# EAGLE design PiGarage (EAGLE 9.5.2)
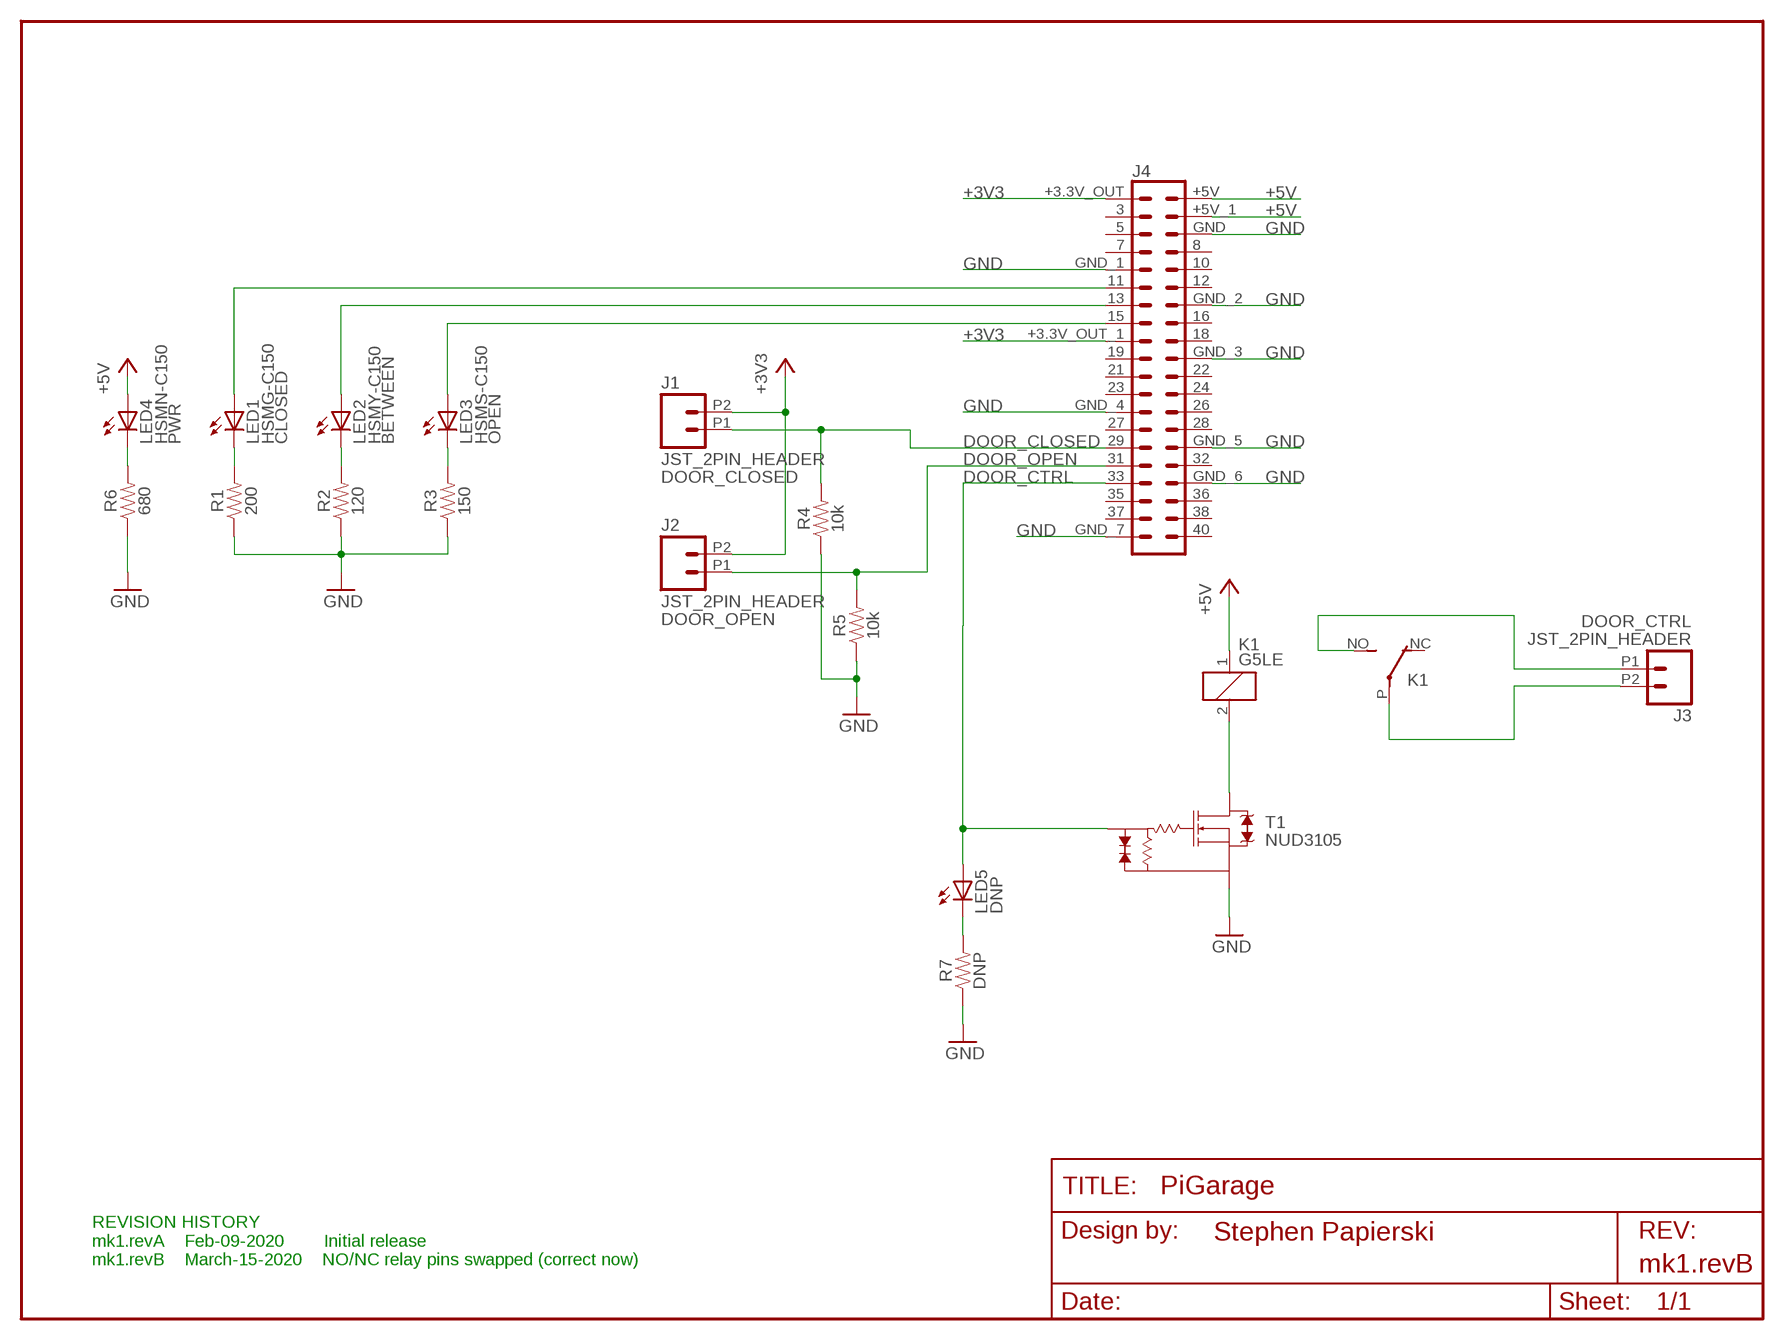
[diagram p0: schematic, sheet 1]

## Parts
FRAME1  FRAME-LETTERNO_PACKAGE  [DUMMY]
J1  JST_2PIN_HEADER  [JST_2PIN_RIGHT_HEADER]
J2  JST_2PIN_HEADER  [JST_2PIN_RIGHT_HEADER]
J3  JST_2PIN_HEADER  [JST_2PIN_RIGHT_HEADER]
J4  RPI-GPIO-20X2  [RPI-GPIO-20X2]
K1  G5LE  [G5LE]
LED1  HSMG-C150  LEDCHIPLED_1206  [CHIPLED_1206]
LED2  HSMY-C150  LEDCHIPLED_1206  [CHIPLED_1206]
LED3  HSMS-C150  LEDCHIPLED_1206  [CHIPLED_1206]
LED4  HSMN-C150  LEDCHIPLED_1206  [CHIPLED_1206]
LED5  DNP  LEDCHIPLED_1206  [CHIPLED_1206]
R1  200  RESISTOR0805  [0805]
R2  120  RESISTOR0805  [0805]
R3  150  RESISTOR0805  [0805]
R4  10k  RESISTOR0805  [0805]
R5  10k  RESISTOR0805  [0805]
R6  680  RESISTOR0805  [0805]
R7  DNP  RESISTOR0805  [0805]
T1  NUD3105  [SOT23]

## Nets
+3V3: J1.P2 J2.P2 J4.+3.3V_OUT J4.+3.3V_OUT_1
+5V: J4.+5V J4.+5V_1 K1.1 LED4.A
DOOR_CLOSED: J1.P1 J4.29 R4.2
DOOR_CTRL: J4.33 LED5.A T1.1(G)
DOOR_OPEN: J2.P1 J4.31 R5.2
GND: J4.GND J4.GND_1 J4.GND_2 J4.GND_3 J4.GND_4 J4.GND_5 J4.GND_6 J4.GND_7 R1.1 R2.1 R3.1 R4.1 R5.1 R6.1 R7.1 T1.2(S)
N$1: K1.2 T1.3(D)
N$2: LED5.C R7.2
N$4: J3.P1 K1.NO(2:NO)
N$5: J3.P2 K1.P(2:P)
N$6: LED4.C R6.2
N$7: J4.11 LED1.A
N$8: J4.13 LED2.A
N$9: J4.15 LED3.A
N$11: LED1.C R1.2
N$12: LED2.C R2.2
N$13: LED3.C R3.2
Unconnected: J4.3 J4.5 J4.7 J4.8 J4.10 J4.12 J4.16 J4.18 J4.19 J4.21 J4.22 J4.23 J4.24 J4.26 J4.27 J4.28 J4.32 J4.35 J4.36 J4.37 J4.38 J4.40 K1.NC(2:NC)

## Notes on the sheet
- PWR | CLOSED | BETWEEN | OPEN
- DOOR_CLOSED
- DOOR_CTRL
- DOOR_OPEN
- REVISION HISTORY
  mk1.revA    Feb-09-2020        Initial release
  mk1.revB    March-15-2020    NO/NC relay pins swapped (correct now)

## Library data of the parts
FRAME1 = eagle_stephen_v1.1:FRAME-LETTER: Schematic Frame - Letter Standard 8.5x11 US Letter frame; DESIGNER: Stephen Papierski; REV: mk1.revB
J1-J3 = eagle_stephen_v1.1:JST_2PIN_HEADER: 2 Pin JST Shrouded Header https://www.sparkfun.com/products/9914
J4 = eagle_stephen_v1.1:RPI-GPIO-20X2: Raspberry Pi GPIO Pinout On any of the 0.1 inch spaced packages, you can populate with these: Stackable 0.100" Female Header 2x20-Pin, Straight <https://www.pololu.com/product/2748> (PRT-2748)
K1 = eagle_stephen_v1.1:G5LE: RELAY 1 x switch, 10 A/120 V AC, 8 A/30 V DC, Omron; OC_FARNELL: unknown; OC_NEWARK: unknown
LED1-LED5 = led:LED: LED OSRAM: - CHIPLED LG R971, LG N971, LY N971, LG Q971, LY Q971, LO R971, LY R971 LH N974, LH R974 LS Q976, LO Q976, LY Q976 LO Q996 - Hyper CHIPLED LW Q18S LB Q993, LB Q99A, LB R99A - SideLED LS A670, LO A670, LY A670, LG A670, LP A670 LB A673, LV A673, LT A673, LW A673 LH A674 LY A675 LS A676, LA A676, LO A676, LY A676, LW A676 LS A679, LY A679, LG A679 - Hyper Micro SIDELED® LS Y876, LA Y876, LO Y876, LY Y876 LT Y87S - SmartLED LW L88C, LW L88S LB L89C, LB L89S, LG L890 LS L89K, LO L89K, LY L89K LS L896, LA L896, LO L896, LY L896 - TOPLED LS T670, LO T670, LY T670, LG T670, LP T670 LSG T670, LSP T670, LSY T670, LOP T670, LYG T670 LG T671, LOG T671, LSG T671 LB T673, LV T673, LT T673, LW T673 LH T674 LS T676, LA T676, LO T676, LY T676, LB T676, LH T676, LSB T676, LW T676 LB T67C, LV T67C, LT T67C, LS T67K, LO T67K, LY T67K, LW E67C LS E67B, LA E67B, LO E67B, LY E67B, LB E67C, LV E67C, LT E67C LW T67C LS T679, LY T679, LG T679 LS T770, LO T770, LY T770, LG T770, LP T770 LB T773, LV T773, LT T773, LW T773 LH T774 LS E675, LA E675, LY E675, LS T675 LS T776, LA T776, LO T776, LY T776, LB T776 LHGB T686 LT T68C, LB T68C - Hyper Mini TOPLED® LB M676 - Mini TOPLED Santana® LG M470 LS M47K, LO M47K, LY M47K Source: http://www.osram.convergy.de LUXEON: - LUMILED® LXK2-PW12-R00, LXK2-PW12-S00, LXK2-PW14-U00, LXK2-PW14-V00 LXK2-PM12-R00, LXK2-PM12-S00, LXK2-PM14-U00 LXK2-PE12-Q00, LXK2-PE12-R00, LXK2-PE12-S00, LXK2-PE14-T00, LXK2-PE14-U00 LXK2-PB12-K00, LXK2-PB12-L00, LXK2-PB12-M00, LXK2-PB14-N00, LXK2-PB14-P00, LXK2-PB14-Q00 LXK2-PR12-L00, LXK2-PR12-M00, LXK2-PR14-Q00, LXK2-PR14-R00 LXK2-PD12-Q00, LXK2-PD12-R00, LXK2-PD12-S00 LXK2-PH12-R00, LXK2-PH12-S00 LXK2-PL12-P00, LXK2-PL12-Q00, LXK2-PL12-R00 Source: www.luxeon.com KINGBRIGHT: KA-3528ASYC Source: www.kingbright.com
R1-R7 = SparkFun-Resistors:RESISTOR: Generic Resistor Package
T1 = eagle_stephen_v1.1:NUD3105: Integrated Relay, Inductive Load Driver This device is used to switch inductive loads such as relays, solenoids, incandescent lamps, and small DC motors without the need of a free−wheeling diode. The device integrates all necessary items such as the MOSFET switch, ESD protection, and Zener clamps. It accepts logic level inputs thus allowing it to be driven by a large variety of devices including logic gates, inverters, and microcontrollers.

## Board
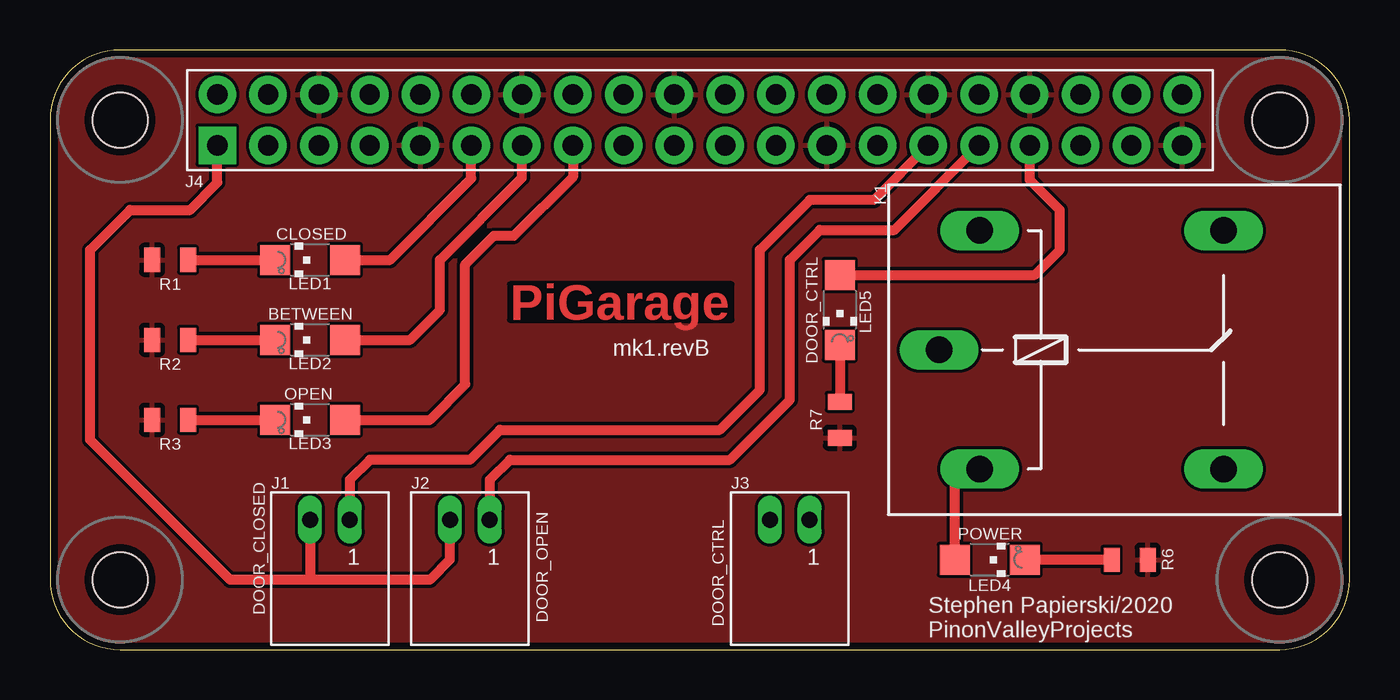
[diagram p1: board, top side]
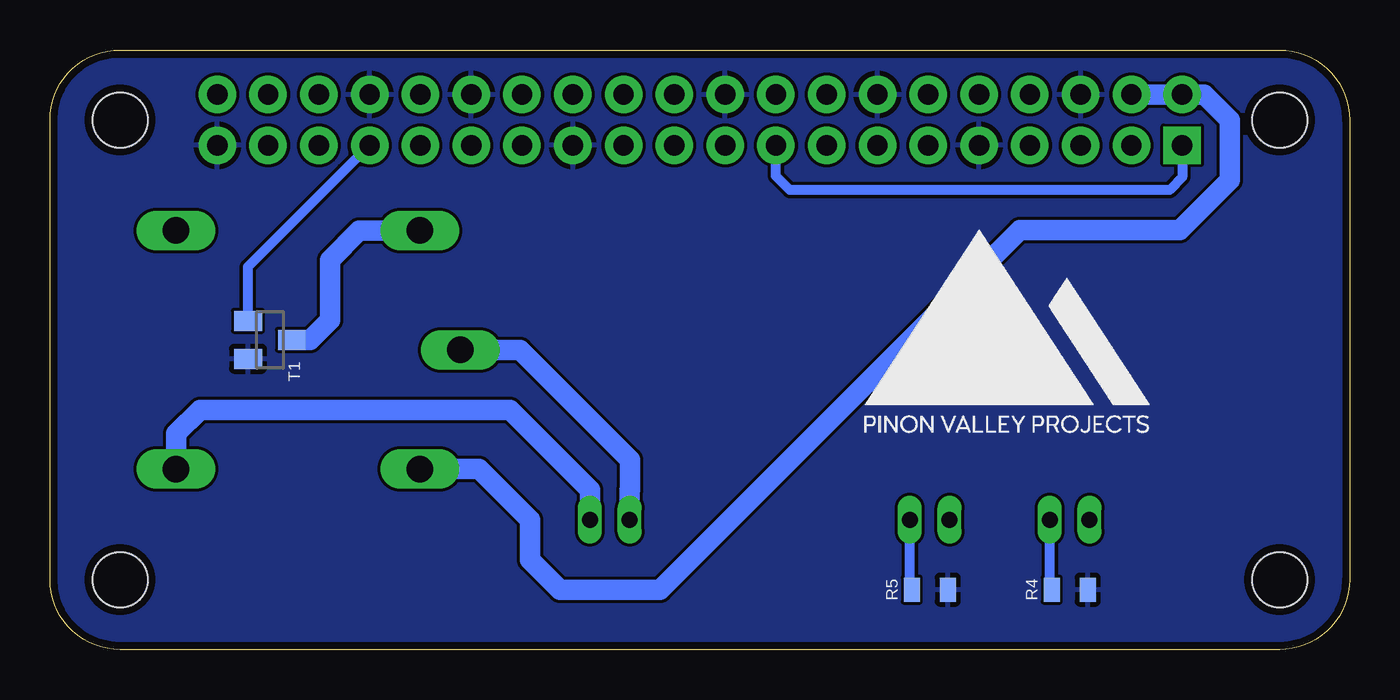
[diagram p2: board, bottom side, seen from below]

Size 65 x 30 mm. Coordinates in mm from the lower left corner, seen from the top.
Outline: 3.5,0 61.5,0 arc90 65,3.5 65,26.5 arc90 61.5,30 3.5,30 arc90 0,26.5 0,3.5 arc90 3.5,0
Copper layers (1*16): Top 0.035559375mm / dielectric 1.6mm / Bottom 0.035559375mm
Design rules "oshpark-2layer": minimum track width 6mil, minimum drill 10mil, track to track 6mil, track to pad 6mil, pad to pad 6mil, via to via 6mil, smd to smd 6mil, copper to edge 15mil, drill to drill 6mil, minimum pad ring 5mil, minimum via ring 5mil, stop-mask expansion 2.5mil, vias tented up to drill 0mil, thermal gap 10mil
Holes 2.75 mm at 3.5,3.5 3.5,26.5 61.5,26.5 61.5,3.5

### Footprints (pad centres in the part's own frame; a part is rotated, then mirrored left to right if it is on the bottom)
JST_2PIN_RIGHT_HEADER = drill 0.8 long: P1 1,0; P2 -1,0
RPI-GPIO-20X2 = drill 1.016 pad 1.88: 3 -21.59,-1.27; 5 -19.05,-1.27; 7 -16.51,-1.27; 8 -16.51,1.27; 10 -13.97,1.27; 11 -11.43,-1.27; 12 -11.43,1.27; 13 -8.89,-1.27; 15 -6.35,-1.27; 16 -6.35,1.27; 18 -3.81,1.27; 19 -1.27,-1.27; 21 1.27,-1.27; 22 1.27,1.27; 23 3.81,-1.27; 24 3.81,1.27; 26 6.35,1.27; 27 8.89,-1.27; 28 8.89,1.27; 29 11.43,-1.27; 31 13.97,-1.27; 32 13.97,1.27; 33 16.51,-1.27; 35 19.05,-1.27; 36 19.05,1.27; 37 21.59,-1.27; 38 21.59,1.27; 40 24.13,1.27; +3.3V_OUT_1 -3.81,-1.27; +5V -24.13,1.27; +5V_1 -21.59,1.27; GND -19.05,1.27; GND_1 -13.97,-1.27; GND_2 -8.89,1.27; GND_3 -1.27,1.27; GND_4 6.35,-1.27; GND_5 11.43,1.27; GND_6 16.51,1.27; GND_7 24.13,-1.27 | drill 1.016 pad 1.88 square: +3.3V_OUT -24.13,-1.27
G5LE = drill 1.321 long: 1 -7.493,-5.969; 2 -7.493,5.969; NC 4.699,5.969; NO 4.699,-5.969; P -9.525,0
CHIPLED_1206 = smd 1.5 x 1.5: A 0,-1.75; C 0,1.75
0805 = smd 0.8 x 1.2: 1 -0.9,0; 2 0.9,0
SOT23 = smd 1 x 1.4: 1 -0.95,-1.1; 2 0.95,-1.1; 3 0,1.1

### Placement (x,y rotation side)
FRAME1  -0.6,-3.2 0 top  (outside the outline)
J1  14,6.5 0 top
J2  21,6.5 0 top
J3  37,6.5 0 top
J4  32.5,26.5 0 top
K1  54,15 0 top
LED1  13,19.5 90 top
LED2  13,15.5 90 top
LED3  13,11.5 90 top
LED4  47,4.5 270 top
LED5  39.5,17 180 top
R1  6,19.5 0 top
R2  6,15.5 0 top
R3  6,11.5 0 top
R4  14,3 180 bottom
R5  21,3 180 bottom
R6  54,4.5 180 top
R7  39.5,11.5 90 top
T1  54,15.5 270 bottom

### Tracks (layer width: path | path; a pad name or v marks a point on that pad's centre or on a via)
+3V3
  Top 0.508: J2.P2 20,4.5 19,3.5 13,3.5 | 13,3.5 9,3.5 2,10.5 2,20 4,22 7,22 8.37,23.37 J4.+3.3V_OUT | J1.P2 13,3.5 | 13,3.5
  Bottom 0.508: J4.+3.3V_OUT 8.37,23.63 9,23 28,23 28.69,23.69 J4.+3.3V_OUT_1
+5V
  Top 0.508: LED4.A 45.25,8.75 45.53,9.03 K1.1
  Bottom 1.016: K1.1 43.53,9.03 41,6.5 41,4.5 39.5,3 34.5,3 16.5,21 8.5,21 6,23.5 6,26.5 7.27,27.77 J4.+5V J4.+5V_1
DOOR_CLOSED
  Top 0.508: J4.29 41.2,22.5 38,22.5 35.5,20 35.5,13 33.5,11 22.5,11 21,9.5 16,9.5 15,8.5 J1.P1
  Bottom 0.508: J1.P1 | R4.2 15,3.1 J1.P1
DOOR_CTRL
  Top 0.508: LED5.A 49.25,18.75 50.5,20 50.5,22 49.01,23.49 J4.33
  Bottom 0.508: J4.33 55.1,19.14 T1.1
DOOR_OPEN
  Top 0.508: J4.31 42.24,21 38.5,21 37,19.5 37,12.5 34,9.5 23,9.5 22,8.5 J2.P1
  Bottom 0.508: J2.P1 | R5.2 22,3.1 J2.P1
GND
  pour Top: 0,-2.5 65,-2.5 65,30 0,30
  pour Bottom: -0.5,-3 65.5,-3 65.5,30.5 -0.5,30.5
N$1
  Bottom 1.016: T1.3 52,15.5 51,16.5 51,19.5 49.53,20.97 K1.2
N$2
  Top 0.508: LED5.C R7.2
N$4
  Bottom 1.016: J3.P1 38,8 42,12 57.5,12 58.7,10.8 K1.NO
N$5
  Bottom 1.016: J3.P2 36,8 | 36,8 | 36,8 36,9.5 41.5,15 K1.P
N$6
  Top 0.508: R6.2 LED4.C
N$7
  Top 0.508: J4.11 21.07,23.57 17,19.5 LED1.A
N$8
  Top 0.508: J4.13 23.61,23.61 19.5,19.5 19.5,17 18,15.5 LED2.A
N$9
  Top 0.508: LED3.A 19,11.5 20.77,13.27 20.77,19.27 22.2,20.7 23.2,20.7 26.15,23.65 J4.15
N$11
  Top 0.508: R1.2 LED1.C
N$12
  Top 0.508: R2.2 LED2.C
N$13
  Top 0.508: R3.2 LED3.C

### Text on the board
Top: PiGarage
tPlace: CLOSED | BETWEEN | mk1.revB | DOOR_CTRL | OPEN | DOOR_OPEN | DOOR_CTRL | POWER | Stephen Papierski/2020 / PinonValleyProjects | DOOR_CLOSED
tStop: PiGarage